# EAGLE schematic thermal-flashlight (EAGLE 6.4)
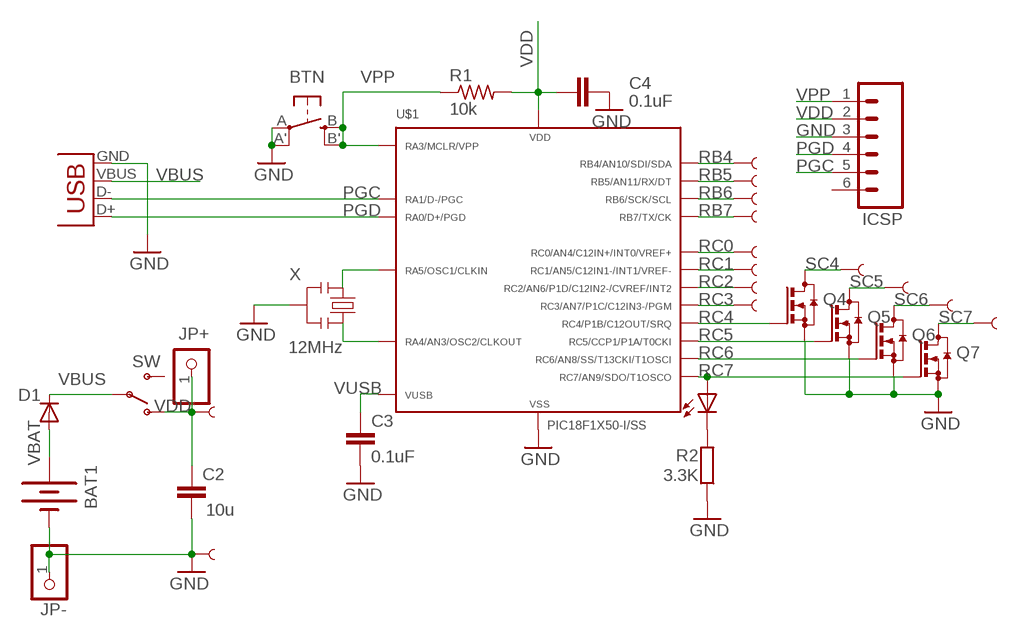
[diagram p0: schematic, sheet 1]

## Parts
BAT1  BATTERY20MM_4LEGS  [BATTCON_20MM_4LEGS]
BTN  EVQQ2  [EVQ-Q2]
C2  10u  C-EUC0805  [C0805]
C3  0.1uF  C-EUC0805  [C0805]
C4  0.1uF  C-EUC0805  [C0805]
D1  DIODESOT23  [SOT23-3]
ICSP  M06SIP  [1X06]
JP+  PINHD-1X1CB  [1X01-CLEANBIG]
JP-  PINHD-1X1CB  [1X01-CLEANBIG]
LED  0805  LEDCHIPLED_0805  [CHIPLED_0805]
PB4  SEWTAP61  [PETAL-SMALL-2SIDE1]
PB5  SEWTAP6  SEWTAP61  [PETAL-SMALL-2SIDE1]
PB6  SEWTAP6  SEWTAP61  [PETAL-SMALL-2SIDE1]
PB7  SEWTAP6  SEWTAP61  [PETAL-SMALL-2SIDE1]
PC0  SEWTAP6  SEWTAP61  [PETAL-SMALL-2SIDE1]
PC1  SEWTAP6  SEWTAP61  [PETAL-SMALL-2SIDE1]
PC2  SEWTAP6  SEWTAP61  [PETAL-SMALL-2SIDE1]
PC3  SEWTAP6  SEWTAP61  [PETAL-SMALL-2SIDE1]
PG  SEWTAP6  SEWTAP611  [PETAL-SMALL-2SIDE11]
PSC4  SEWTAP6  SEWTAP61  [PETAL-SMALL-2SIDE1]
PSC5  SEWTAP6  SEWTAP61  [PETAL-SMALL-2SIDE1]
PSC6  SEWTAP6  SEWTAP61  [PETAL-SMALL-2SIDE1]
PSC7  SEWTAP6  SEWTAP61  [PETAL-SMALL-2SIDE1]
PVCC  SEWTAP6  SEWTAP611  [PETAL-SMALL-2SIDE11]
Q4  BSS123  [SOT23]
Q5  BSS123  [SOT23]
Q6  BSS123  [SOT23]
Q7  BSS123  [SOT23]
R1  10k  R-US_R0805  [R0805@1]
R2  3.3K  R-EU_R0805  [R0805]
SW  SPDT  SWITCH-SPSTSMD2  [SWITCH-SPDT-SMD]
U$1  PIC18F1X50-I/SS  [SSOP20]
X  12MHz  RESONATORSMD  [RESONATOR-SMD]
X1  USBSMD  [USB-MINIB]

## Nets
GND: BAT1.2(-) BTN.A'(P1) BTN.A(P) C2.2 C3.2 C4.2 ICSP.3 JP-.1 PG.1 Q4.2(S) Q5.2(S) Q6.2(S) Q7.2(S) R2.1 U$1.20 X1.GND X.2
N$2: U$1.2 X.1
N$3: U$1.3 X.3
N$14: LED.C R2.2
PGC: ICSP.5 U$1.18 X1.D-
PGD: ICSP.4 U$1.19 X1.D+
RB4: PB4.1 U$1.13
RB5: PB5.1 U$1.12
RB6: PB6.1 U$1.11
RB7: PB7.1 U$1.10
RC0: PC0.1 U$1.16
RC1: PC1.1 U$1.15
RC2: PC2.1 U$1.14
RC3: PC3.1 U$1.7
RC4: Q4.1(G) U$1.6
RC5: Q5.1(G) U$1.5
RC6: Q6.1(G) U$1.8
RC7: LED.A Q7.1(G) U$1.9
SC4: PSC4.1 Q4.3(D)
SC5: PSC5.1 Q5.3(D)
SC6: PSC6.1 Q6.3(D)
SC7: PSC7.1 Q7.3(D)
VBAT: BAT1.1(+) D1.1(A)
VBUS: D1.3(C) SW.2(P) X1.VBUS
VDD: C2.1 C4.1 ICSP.2 JP+.1 PVCC.1 R1.2 SW.1(O) U$1.1
VPP: BTN.B'(S1) BTN.B(S) ICSP.1 R1.1 U$1.4
VUSB: C3.1 U$1.17
Unconnected: ICSP.6 SW.3(S)

## Library data of the parts
BAT1 = SparkFunNew:BATTERY: Battery Holders Various common sizes : AA, AAA, 20mm coin cell and 12mm coin cell.
BTN = adafruit:EVQQ2: SMT 6mm switch, EVQQ2 series http://www.ladyada.net/library/eagle
C2 = resistor:C-EU: CAPACITOR, European symbol
C3 C4 = rcl:C-EU: CAPACITOR, European symbol
D1 = SparkFun:DIODE: Diode These are standard reverse protection diodes and small signal diodes. SMA package can handle up to about 1A. SOD-323 can handle about 200mA. What the SOD-323 package when ordering, there are some mfgs out there that are 5-pin packages.
ICSP = SparkFunNew:M06: Header 6 Standard 6-pin 0.1" header. Use with straight break away headers (SKU : PRT-00116), right angle break away headers (PRT-00553), swiss pins (PRT-00743), machine pins (PRT-00117), and female headers (PRT-00115). Molex polarized connector foot print use with SKU : PRT-08094 with associated crimp pins and housings. NOTES ON THE VARIANTS LOCK and LOCK_LONGPADS... This footprint was designed to help hold the alignment of a through-hole component (i.e. 6-pin header) while soldering it into place. You may notice that each hole has been shifted either up or down by 0.005 of an inch from it's more standard position (which is a perfectly straight line). This slight alteration caused the pins (the squares in the middle) to touch the edges of the holes. Because they are alternating, it causes a "brace" to hold the component in place. 0.005 has proven to be the perfect amount of "off-center" position when using our standard breakaway headers. Although looks a little odd when you look at the bare footprint, once you have a header in there, the alteration is very hard to notice. Also, if you push a header all the way into place, it is covered up entirely on the bottom side. This idea of altering the position of holes to aid alignment will be further integrated into the Sparkfun Library for other footprints. It can help hold any component with 3 or more connection pins.
JP+ JP- = adafruit:PINHD-1X1: Pin header 1x1 for 0.1" spacing With round pins
LED = led:LED: LED OSRAM: - CHIPLED LG R971, LG N971, LY N971, LG Q971, LY Q971, LO R971, LY R971 LH N974, LH R974 LS Q976, LO Q976, LY Q976 LO Q996 - Hyper CHIPLED LW Q18S LB Q993, LB Q99A, LB R99A - SideLED LS A670, LO A670, LY A670, LG A670, LP A670 LB A673, LV A673, LT A673, LW A673 LH A674 LY A675 LS A676, LA A676, LO A676, LY A676, LW A676 LS A679, LY A679, LG A679 - Hyper Micro SIDELED® LS Y876, LA Y876, LO Y876, LY Y876 LT Y87S - SmartLED LW L88C, LW L88S LB L89C, LB L89S, LG L890 LS L89K, LO L89K, LY L89K LS L896, LA L896, LO L896, LY L896 - TOPLED LS T670, LO T670, LY T670, LG T670, LP T670 LSG T670, LSP T670, LSY T670, LOP T670, LYG T670 LG T671, LOG T671, LSG T671 LB T673, LV T673, LT T673, LW T673 LH T674 LS T676, LA T676, LO T676, LY T676, LB T676, LH T676, LSB T676, LW T676 LB T67C, LV T67C, LT T67C, LS T67K, LO T67K, LY T67K, LW E67C LS E67B, LA E67B, LO E67B, LY E67B, LB E67C, LV E67C, LT E67C LW T67C LS T679, LY T679, LG T679 LS T770, LO T770, LY T770, LG T770, LP T770 LB T773, LV T773, LT T773, LW T773 LH T774 LS E675, LA E675, LY E675, LS T675 LS T776, LA T776, LO T776, LY T776, LB T776 LHGB T686 LT T68C, LB T68C - Hyper Mini TOPLED® LB M676 - Mini TOPLED Santana® LG M470 LS M47K, LO M47K, LY M47K Source: http://www.osram.convergy.de LUXEON: - LUMILED® LXK2-PW12-R00, LXK2-PW12-S00, LXK2-PW14-U00, LXK2-PW14-V00 LXK2-PM12-R00, LXK2-PM12-S00, LXK2-PM14-U00 LXK2-PE12-Q00, LXK2-PE12-R00, LXK2-PE12-S00, LXK2-PE14-T00, LXK2-PE14-U00 LXK2-PB12-K00, LXK2-PB12-L00, LXK2-PB12-M00, LXK2-PB14-N00, LXK2-PB14-P00, LXK2-PB14-Q00 LXK2-PR12-L00, LXK2-PR12-M00, LXK2-PR14-Q00, LXK2-PR14-R00 LXK2-PD12-Q00, LXK2-PD12-R00, LXK2-PD12-S00 LXK2-PH12-R00, LXK2-PH12-S00 LXK2-PL12-P00, LXK2-PL12-Q00, LXK2-PL12-R00 Source: www.luxeon.com KINGBRIGHT: KA-3528ASYC Source: www.kingbright.com
PB4-PB7 PC0 PC1-PC3 PG PSC4-PSC7 PVCC = LilyPad-Wearables:SEWTAP
Q4-Q7 = transistor-small-signal:BSS123: N-CHANNEL MOS FET
R1 = rcl:R-US_: RESISTOR, American symbol
R2 = rcl:R-EU_: RESISTOR, European symbol
SW = SparkFun:SWITCH-SPST: SPST Switch Simple slide switch. Spark Fun Electronics SKU : COM-00102
U$1 = Forrequi:PIC18F1X50: PIC18F13K50/14K50 20-Pin USB Flash Microcontrollers with nanoWatt Technology The PIC18F14K50 brings advanced features and exceptional value to the embedded USB market. This low cost PIC® Microcontroller features a full speed USB 2.0 compliant interface that c an automatically change clock sources and power levels upon connection to a host, making it an exceptional device for battery-powered applications. The addition of mTouch(TM) touch sensing compatibility, a 10-bit ADC, motor control PWMs, and a host of serial interfaces make the PIC18F14K50 the perfect device to "Just add USB" to any application. Datasheet <http://ww1.microchip.com/downloads/en/DeviceDoc/41350C.pdf>
X = SparkFunNew:RESONATOR: Resonator Small SMD resonator. This is the itty bitty 10/20MHz resonators with built in caps. CSTCE10M0G55 and CSTCE20M0V53. Footprint has been reviewed closely but hasn't been tested yet.
X1 = SparkFun:USB: USB Connectors USB-B-PTH is fully proven SKU : PRT-00139 USB-miniB is fully proven SKU : PRT-00587 USB-A-PCB is untested. USB-A-H is throughly reviewed, but untested. Spark Fun Electronics SKU : PRT-00437 USB-B-SMT is throughly reviewed, but untested. Needs silkscreen touching up. USB-A-S has not been used/tested USB-MB-H has not been used/tested

## Net classes
0 default: width 0.254 mm, clearance 0.203 mm
1 power: width 0.254 mm, clearance 0.203 mm